# Altium schematic sheet TxPCB.SchDoc: Tabellone Tx: PCB
size A4; Organization: IISS G. Cigna; Address2: Fabio Fenoglio; Address3: Daniele Viglietti; DocumentNumber: 1; Revision: 1.A; SheetNumber: 1; SheetTotal: 1
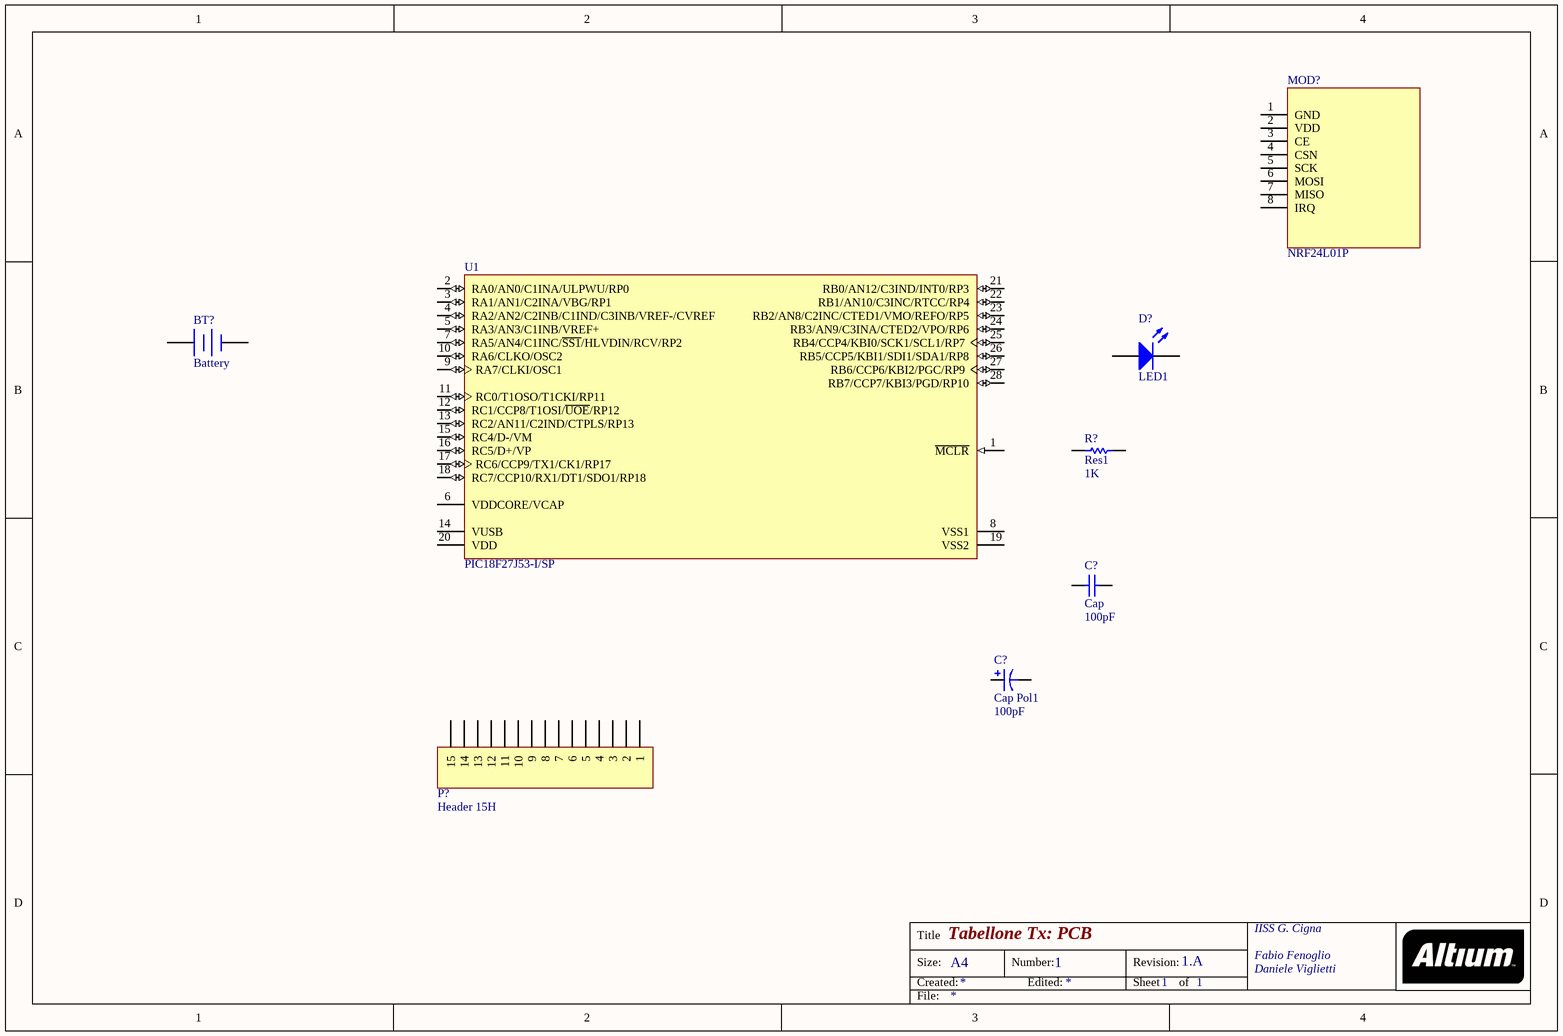
[diagram p0: TxPCB.SchDoc]

## Parts
(Parts that share a designator on the sheet are numbered #1, #2 ... from top to bottom, then left to right.)
BT?  Battery  [BAT-2]
C?#1  Cap  value 100pF  [RAD-0.3]
C?#2  Cap Pol1  value 100pF  [RB7.6-15]
D?  LED1  [LED-1]
MOD?  NRF24L01P  [HDR2X4]
P?  Header 15H  [HDR1X15H]
R?  Res1  value 1K  [AXIAL-0.3]
U1  PIC18F27J53-I/SP  [MCHP-SPDIP-SP28]

## Nets

Not connected (* = marked no-connect by the designer): BT? 1(+) 2(-); C?#1 1 2; C?#2 1 2; D? 1(A) 2(K); MOD? 1(GND) 2(VDD) 3(CE) 4(CSN) 5(SCK) 6(MOSI) 7(MISO) 8(IRQ); P? 1 2 3 4 5 6 7 8 9 10 11 12 13 14 15; R? 1 2; U1 1(~{MCLR}) 2(RA0/AN0/C1INA/ULPWU/RP0) 3(RA1/AN1/C2INA/VBG/RP1) 4(RA2/AN2/C2INB/C1IND/C3INB/VREF-/CVREF) 5(RA3/AN3/C1INB/VREF+) 6(VDDCORE/VCAP) 7(RA5/AN4/C1INC/~{SS1}/HLVDIN/RCV/RP2) 8(VSS1) 9(RA7/CLKI/OSC1) 10(RA6/CLKO/OSC2) 11(RC0/T1OSO/T1CKI/RP11) 12(RC1/CCP8/T1OSI/~{UOE}/RP12) 13(RC2/AN11/C2IND/CTPLS/RP13) 14(VUSB) 15(RC4/D-/VM) 16(RC5/D+/VP) 17(RC6/CCP9/TX1/CK1/RP17) 18(RC7/CCP10/RX1/DT1/SDO1/RP18) 19(VSS2) 20(VDD) 21(RB0/AN12/C3IND/INT0/RP3) 22(RB1/AN10/C3INC/RTCC/RP4) 23(RB2/AN8/C2INC/CTED1/VMO/REFO/RP5) 24(RB3/AN9/C3INA/CTED2/VPO/RP6) 25(RB4/CCP4/KBI0/SCK1/SCL1/RP7) 26(RB5/CCP5/KBI1/SDI1/SDA1/RP8) 27(RB6/CCP6/KBI2/PGC/RP9) 28(RB7/CCP7/KBI3/PGD/RP10)

## Notes on the sheet
- Title
- Size:
- Created:
- A4
- Number:
- Edited:
- Revision:
- Sheet
- of
- File:

## Library data of the parts
BT? = Battery: Multicell Battery; Published: 24-Mar-1999; LatestRevisionDate: 17-Jul-2002; LatestRevisionNote: Re-released for DXP Platform.; PackageReference: BAT-2; Publisher: Altium Limited; PackageDescription: Battery; 2 Leads
C?#1 = Cap: Capacitor; Published: 8-Jun-2000; LatestRevisionDate: 17-Jul-2002; LatestRevisionNote: Re-released for DXP Platform.; PackageReference: RAD-0.3; Publisher: Altium Limited; PackageDescription: Radial Cap, Thru-Hole; 2 Leads; 0.3 in Pin Spacing
C?#2 = Cap Pol1: Polarized Capacitor (Radial); Published: 8-Jun-2000; LatestRevisionDate: 17-Jul-2002; LatestRevisionNote: Re-released for DXP Platform.; PackageReference: RB7.6-15; Publisher: Altium Limited; PackageDescription: Polarized Capacitor (Radial); 2 Leads
D? = LED1: Typical RED GaAs LED; Published: 8-Jun-2000; LatestRevisionDate: 08-Jul-2005; LatestRevisionNote: Mech Layer 1 removed.; PackageReference: LED-1; Publisher: Altium Limited; PackageDescription: LED; 2 Leads
P? = Header 15H: Header, 15-Pin, Right Angle; LatestRevisionDate: 17-Jul-2002; LatestRevisionNote: Re-released for DXP Platform.; Publisher: Altium Limited
R? = Res1: Resistor; Published: 8-Jun-2000; LatestRevisionDate: 17-Jul-2002; LatestRevisionNote: Re-released for DXP Platform.; PackageReference: AXIAL-0.3; Publisher: Altium Limited; PackageDescription: Axial Device, Thru-Hole; 2 Leads; 0.3 in Pin Spacing
U1 = PIC18F27J53-I/SP: High-Performance USB Microcontroller with nanoWatt XLP Technology, 48 MHz, 22 I/O, -40 to 85 degC, 28-pin SPDIP (SP28), Tube; Manufacturer: Microchip; # of A/D Channels: 10; Digital Communication: 2 -A/E/USART, 2 -MSSP(SPI/I2C); I/O Pins: 22; Internal Oscillator: 8 MHz, 31 kHz; Max. CPU Speed MHz: 48; Memory Type: Flash; Operation Voltage Range: 2.15V - 3.6V; Program Memory KBytes: 128; Program Memory KWords: 64; RAM: 3800; Timers: 4 - 8-bit, 4 - 16-bit; DatasheetVersion: Rev. B; PackageVersion: C04-070B, 12/2012; PackageReference: SPDIP-SP28; PackageDescription: 28-Lead Plastic Dual In-Line, 34.86 x 6.79 mm Body, 2.54 mm Pitch; Supplier 1: Digi-Key; Supplier Part Number 1: PIC18F27J53-I/SP-ND; Supplier 2: Farnell; Supplier Part Number 2: 1814996; Supplier 3: Newark; Supplier Part Number 3: 63R7839; Supplier 4: Mouser; Supplier Part Number 4: 579-PIC18F27J53-I/SP; Packing: TUBE; RoHS: TRUE; Mounting Technology: Through Hole; PartNumber: PIC18F27J53-I/SP; ComponentLink1Description: Datasheet; ComponentLink1URL: http://ww1.microchip.com/downloads/en/DeviceDoc/39964B.pdf; ComponentLink2Description: Package Specification; ComponentLink2URL: http://www.microchip.com/stellent/groups/techpub_sg/documents/packagingspec/en012702.pdf; ComponentLink3Description: URL Link1; ComponentLink3URL: Product URL:http://www.microchip.com/datasheet/PIC18F27J53